# EAGLE schematic master1 (EAGLE 9.5.2)
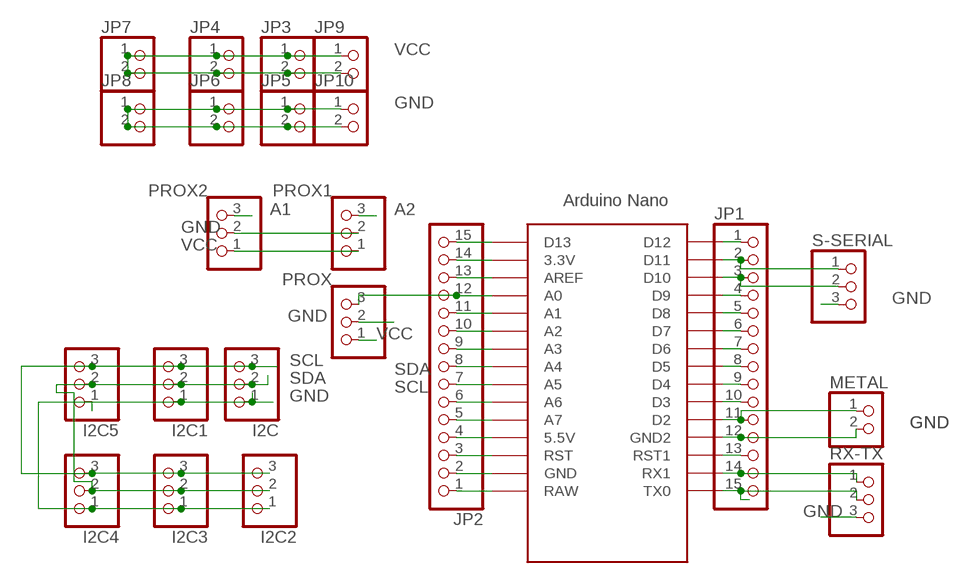
[diagram p0: schematic, sheet 1]

## Parts
I2C  PINHD-3_DATA  [1X03_DATA]
I2C1  PINHD-3_DATA  [1X03_DATA]
I2C2  PINHD-3_DATA  [1X03_DATA]
I2C3  PINHD-3_DATA  [1X03_DATA]
I2C4  PINHD-3_DATA  [1X03_DATA]
I2C5  PINHD-3_DATA  [1X03_DATA]
JP1  PINHD-1X15  [1X15]
JP2  PINHD-1X15  [1X15]
JP3  PINHD-1X2  [1X02]
JP4  PINHD-1X2  [1X02]
JP5  PINHD-1X2  [1X02]
JP6  PINHD-1X2  [1X02]
JP7  PINHD-1X2  [1X02]
JP8  PINHD-1X2  [1X02]
JP9  PINHD-1X2  [1X02]
JP10  PINHD-1X2  [1X02]
METAL  PINHD-2_DATA  [1X02_DATA]
PROX  PINHD-3_DATA  [1X03_DATA]
PROX1  PINHD-3_DATA  [1X03_DATA]
PROX2  PINHD-3_DATA  [1X03_DATA]
RX-TX  PINHD-3_DATA  [1X03_DATA]
S-SERIAL  PINHD-3_DATA  [1X03_DATA]
U$1  ARDUINO_NANO  [NANO]

## Nets
A1: PROX2.3
A2: PROX1.3
GND: I2C1.1 I2C2.1 I2C3.1 I2C4.1 I2C5.1 I2C.1 JP1.12 JP5.1 JP5.2 JP6.1 JP6.2 JP8.1 JP8.2 JP10.1 JP10.2 METAL.2 PROX1.2 PROX2.2 PROX.2 RX-TX.3 S-SERIAL.3 U$1.GND1(GND2)
N$1: JP2.1 U$1.RAW
N$2: JP2.2 U$1.GND
N$3: JP2.3 U$1.RST
N$4: JP2.4 U$1.5V(5.5V)
N$5: JP2.5 U$1.A7
N$6: JP2.6 U$1.A6
N$9: JP2.9 U$1.A3
N$10: JP2.10 U$1.A2
N$11: JP2.11 U$1.A1
N$12: JP2.12 PROX.3 U$1.A0
N$13: JP2.13 U$1.AREF
N$14: JP2.14 U$1.3.3V
N$15: JP2.15 U$1.D13
N$16: JP1.1 U$1.D12
N$17: JP1.2 S-SERIAL.1 U$1.D11
N$18: JP1.3 S-SERIAL.2 U$1.D10
N$19: JP1.4 U$1.D9
N$20: JP1.5 U$1.D8
N$21: JP1.6 U$1.D7
N$22: JP1.7 U$1.D6
N$23: JP1.8 U$1.D5
N$24: JP1.9 U$1.D4
N$25: JP1.10 U$1.D3
N$26: JP1.11 METAL.1 U$1.D2
N$28: JP1.13 U$1.RST1
N$29: JP1.14 RX-TX.1 U$1.RX1
N$30: JP1.15 RX-TX.2 U$1.TX0
SCL: I2C1.3 I2C2.3 I2C3.3 I2C4.3 I2C5.3 I2C.3 JP2.7 U$1.A5
SDA: I2C1.2 I2C2.2 I2C3.2 I2C4.2 I2C5.2 I2C.2 JP2.8 U$1.A4
VCC: JP3.1 JP3.2 JP4.1 JP4.2 JP7.1 JP7.2 JP9.1 JP9.2 PROX1.1 PROX2.1 PROX.1

## Library data of the parts
I2C I2C1-I2C5 PROX PROX1 PROX2 RX-TX S-SERIAL = MIA_LIBRARY-2-2-2:PINHD-3_DATA: PIN HEADER
JP1 JP2 = MIA_LIBRARY-2-2-2:PINHD-1X15: PIN HEADER
JP3-JP10 = MIA_LIBRARY-2-2-2:PINHD-1X2: PIN HEADER
METAL = MIA_LIBRARY-2-2-2:PINHD-2_DATA: PIN HEADER
U$1 = MIA_LIBRARY:ARDUINO_NANO: Arduino Nano